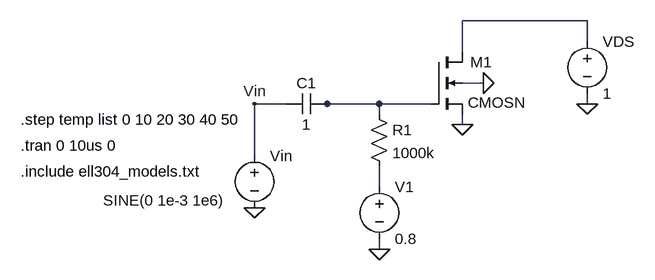
[diagram p0: schematic exmp4.asc]
exmp4.asc, the LTspice schematic file:
Version 4
SHEET 1 880 680
WIRE 384 80 192 80
WIRE 384 112 384 80
WIRE 192 128 192 80
WIRE 224 176 192 176
WIRE -80 208 -128 208
WIRE -16 208 -32 208
WIRE 64 208 -16 208
WIRE 144 208 64 208
WIRE 384 208 384 192
WIRE 64 224 64 208
WIRE 192 240 192 224
WIRE -128 288 -128 208
WIRE 64 336 64 304
WIRE 64 432 64 416
FLAG 384 208 0
FLAG 224 176 0
FLAG 192 240 0
FLAG 64 432 0
FLAG -128 208 Vin
FLAG -128 368 0
SYMBOL nmos4 144 128 R0
WINDOW 0 60 16 Left 2
WINDOW 3 56 78 Left 2
SYMATTR InstName M1
SYMATTR Value CMOSN
SYMATTR Value2 l=0.18u w=5u
SYMBOL voltage 384 96 R0
SYMATTR InstName VDS
SYMATTR Value 1
SYMBOL res 48 208 R0
SYMATTR InstName R1
SYMATTR Value 1000k
SYMBOL voltage 64 320 R0
SYMATTR InstName V1
SYMATTR Value 0.8
SYMBOL cap -16 192 R90
WINDOW 0 0 32 VBottom 2
WINDOW 3 32 32 VTop 2
SYMATTR InstName C1
SYMATTR Value 1
SYMBOL voltage -128 272 R0
WINDOW 3 -233 85 Left 2
WINDOW 123 0 0 Left 0
WINDOW 39 0 0 Left 0
SYMATTR Value SINE(0 1e-3 1e6)
SYMATTR InstName Vin
TEXT -488 312 Left 2 !.include ell304_models.txt
TEXT -488 272 Left 2 !.tran 0 10us 0
TEXT -488 232 Left 2 !.step temp list 0 10 20 30 40 50

The netlist it stands for:
* exmp4.asc
M1 N001 N002 0 0 CMOSN l=0.18u w=5u
VDS N001 0 1
R1 N002 N003 1000k
V1 N003 0 0.8
C1 N002 Vin 1
Vin Vin 0 SINE(0 1e-3 1e6)
.model NMOS NMOS
.model PMOS PMOS
.lib standard.mos
.include ell304_models.txt
.tran 0 10us 0
.step temp list 0 10 20 30 40 50
.backanno
.end